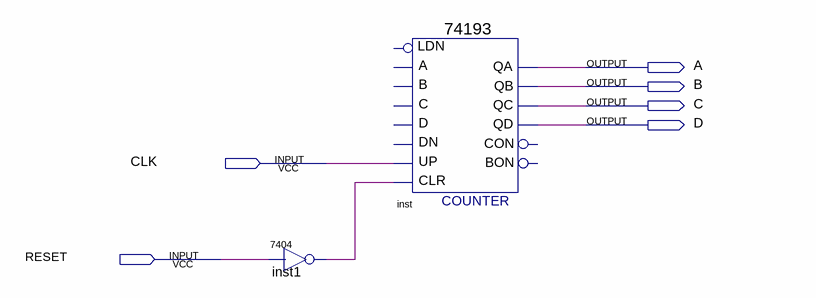
[diagram p0: schematic sheet]
// Quartus schematic main.bdf as structural Verilog: 2 symbols, 6 pins
module main (
  input  CLK,
  input  RESET,
  output A,
  output B,
  output C,
  output D
);

  wire inst1_1;

  \7404  inst1 (.\2 (RESET), .\1 (inst1_1));
  \74193  inst (.CLR(inst1_1), .UP(CLK), .QB(B), .QA(A), .QD(D), .QC(C));  // open: D, C, B, A, DN, LDN, CON, BON
endmodule
